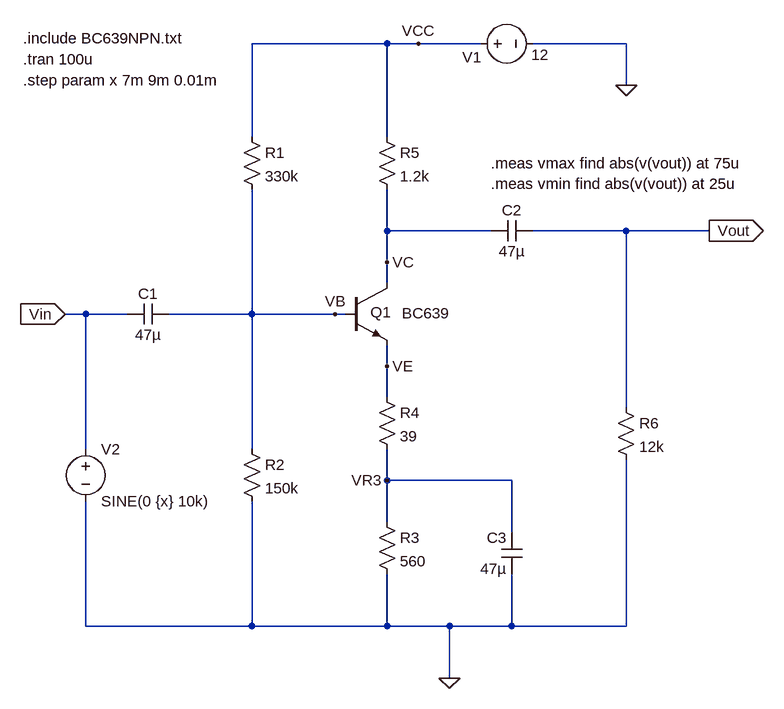
[diagram p0: schematic ACanalysis.asc]
ACanalysis.asc, the LTspice schematic file:
Version 4
SHEET 1 5552 1448
WIRE -512 432 -720 432
WIRE -464 432 -512 432
WIRE -368 432 -464 432
WIRE -144 432 -288 432
WIRE -144 496 -144 432
WIRE -720 576 -720 432
WIRE -512 576 -512 432
WIRE -512 720 -512 656
WIRE -352 720 -512 720
WIRE -144 720 -288 720
WIRE -16 720 -144 720
WIRE -512 768 -512 720
WIRE -512 800 -512 768
WIRE -976 848 -1008 848
WIRE -912 848 -976 848
WIRE -720 848 -720 656
WIRE -720 848 -848 848
WIRE -592 848 -720 848
WIRE -576 848 -592 848
WIRE -512 928 -512 896
WIRE -512 976 -512 928
WIRE -144 992 -144 720
WIRE -976 1056 -976 848
WIRE -720 1056 -720 848
WIRE -512 1104 -512 1056
WIRE -320 1104 -512 1104
WIRE -512 1168 -512 1104
WIRE -320 1184 -320 1104
WIRE -976 1328 -976 1136
WIRE -720 1328 -720 1136
WIRE -720 1328 -976 1328
WIRE -512 1328 -512 1248
WIRE -512 1328 -720 1328
WIRE -416 1328 -512 1328
WIRE -320 1328 -320 1248
WIRE -320 1328 -416 1328
WIRE -144 1328 -144 1072
WIRE -144 1328 -320 1328
WIRE -416 1408 -416 1328
FLAG -416 1408 0
FLAG -144 496 0
FLAG -16 720 Vout
IOPIN -16 720 Out
FLAG -592 848 VB
FLAG -512 928 VE
FLAG -512 768 VC
FLAG -1008 848 Vin
IOPIN -1008 848 In
FLAG -464 432 VCC
FLAG -512 1104 VR3
DATAFLAG -720 496 ""
SYMBOL res -736 560 R0
SYMATTR InstName R1
SYMATTR Value 330k
SYMBOL res -736 1040 R0
SYMATTR InstName R2
SYMATTR Value 150k
SYMBOL res -528 1152 R0
SYMATTR InstName R3
SYMATTR Value 560
SYMBOL res -528 960 R0
SYMATTR InstName R4
SYMATTR Value 39
SYMBOL res -528 560 R0
SYMATTR InstName R5
SYMATTR Value 1.2k
SYMBOL cap -848 832 R90
WINDOW 0 0 32 VBottom 2
WINDOW 3 32 32 VTop 2
SYMATTR InstName C1
SYMATTR Value 47µ
SYMBOL cap -288 704 R90
WINDOW 0 0 32 VBottom 2
WINDOW 3 32 32 VTop 2
SYMATTR InstName C2
SYMATTR Value 47µ
SYMBOL cap -304 1248 R180
WINDOW 0 24 56 Left 2
WINDOW 3 24 8 Left 2
SYMATTR InstName C3
SYMATTR Value 47µ
SYMBOL res -160 976 R0
SYMATTR InstName R6
SYMATTR Value 12k
SYMBOL npn -576 800 R0
WINDOW 0 38 45 Left 2
WINDOW 3 87 47 Left 2
SYMATTR InstName Q1
SYMATTR Value BC639
SYMBOL voltage -384 432 R270
WINDOW 123 0 0 Left 0
WINDOW 39 0 0 Left 0
WINDOW 0 -21 17 VLeft 2
WINDOW 3 -17 94 VRight 2
SYMATTR InstName V1
SYMATTR Value 12
SYMBOL voltage -976 1040 R0
WINDOW 123 0 0 Left 0
WINDOW 39 0 0 Left 0
SYMATTR InstName V2
SYMATTR Value SINE(0 {x} 10k)
TEXT -1072 456 Left 2 !.tran 100u
TEXT -1072 424 Left 2 !.include BC639NPN.txt
TEXT -1072 488 Left 2 !.step param x 7m 9m 0.01m
TEXT -352 616 Left 2 !.meas vmax find abs(v(vout)) at 75u\n.meas vmin find abs(v(vout)) at 25u

The netlist it stands for:
* ACanalysis.asc
R1 VCC VB 330k
R2 VB 0 150k
R3 VR3 0 560
R4 VE VR3 39
R5 VCC VC 1.2k
C1 VB Vin 47µ
C2 Vout VC 47µ
C3 0 VR3 47µ
R6 Vout 0 12k
Q1 VC VB VE 0 BC639
V1 VCC 0 12
V2 Vin 0 SINE(0 {x} 10k)
.model NPN NPN
.model PNP PNP
.lib standard.bjt
.tran 100u
.include BC639NPN.txt
.step param x 7m 9m 0.01m
.meas vmax find abs(v(vout)) at 75u
.meas vmin find abs(v(vout)) at 25u
.backanno
.end